# EAGLE design motoko_ice_dragon_x_bldc (EAGLE 9.6.0)
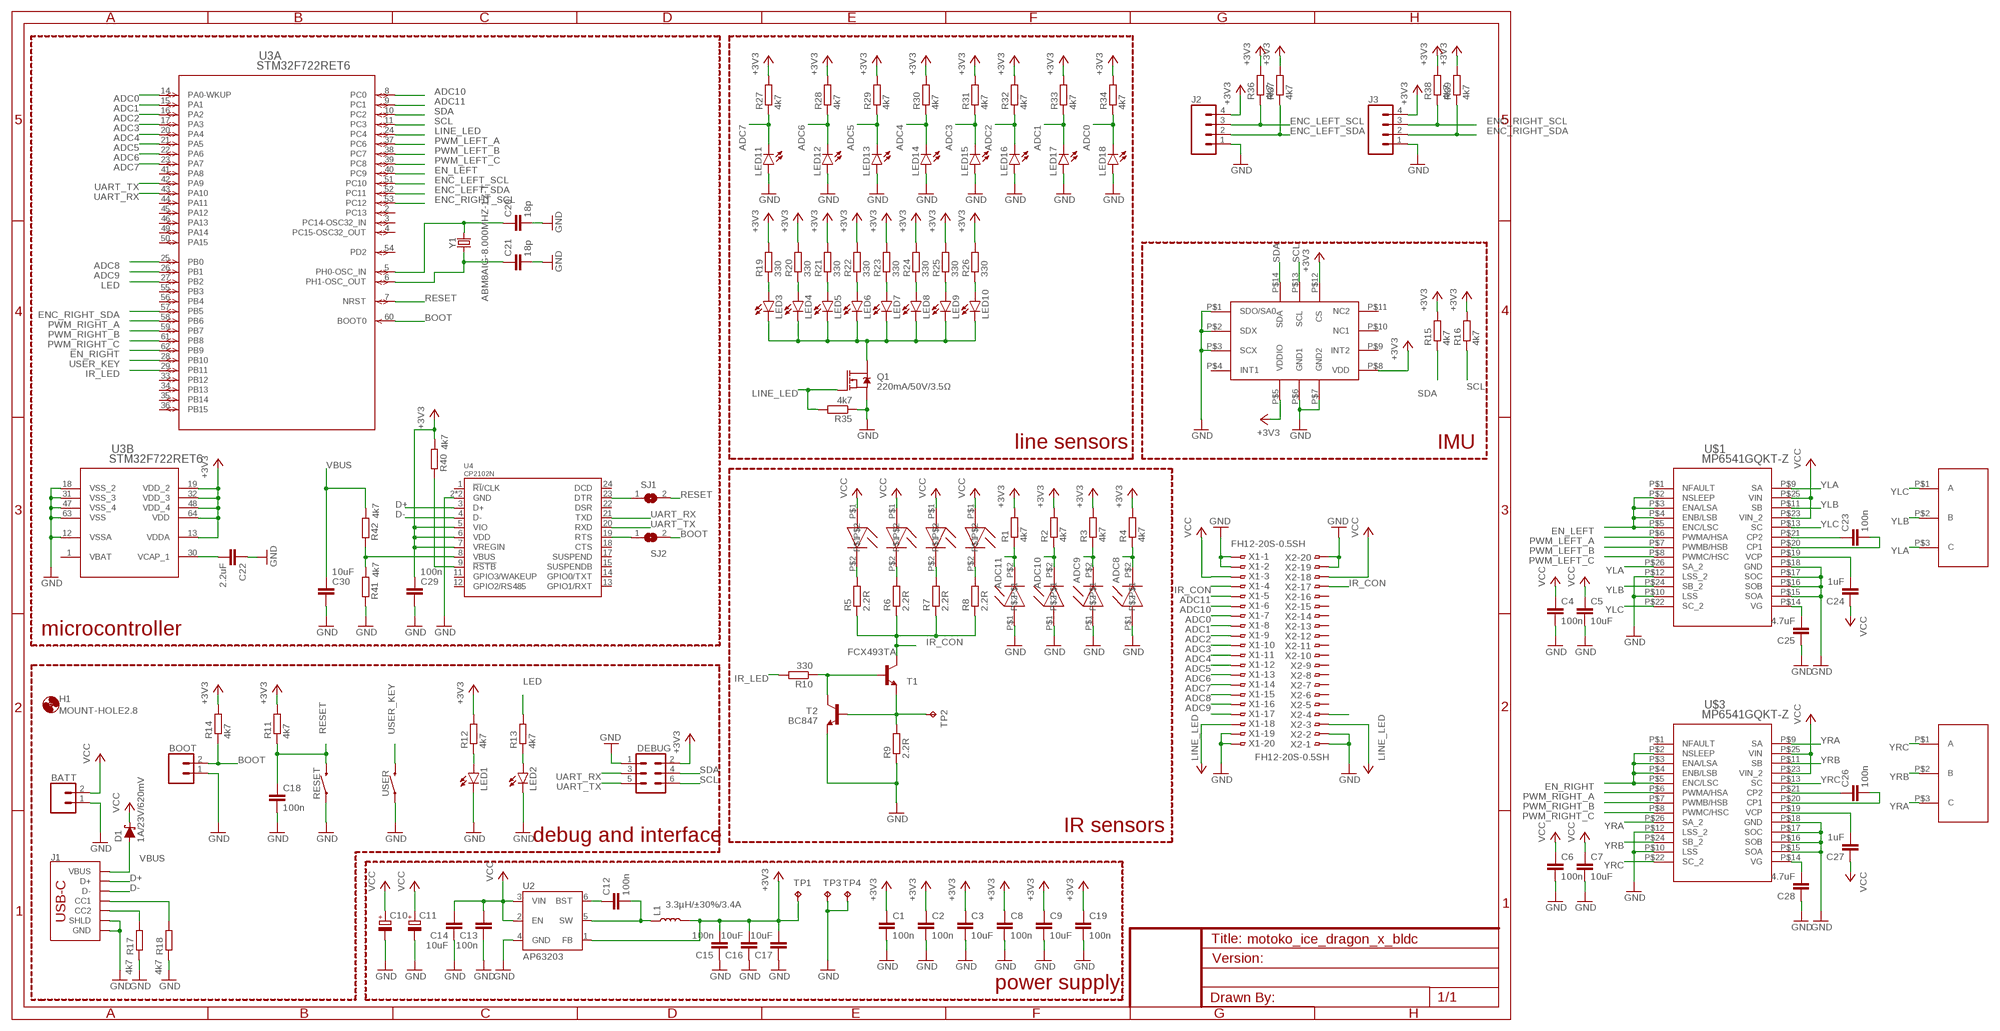
[diagram p0: schematic, sheet 1]

## Parts
BATT  CONN_02LOCK_LONGPADS  [1X02_LOCK_LONGPADS]
BOOT  CONN_02LOCK_LONGPADS  [1X02_LOCK_LONGPADS]
C1  100n  C-EUC0805  [C0805]
C2  100n  C-EUC0805  [C0805]
C3  10uF  C-EUC0805  [C0805]
C4  100n  C-EUC0805  [C0805]
C5  10uF  C-EUC0805  [C0805]
C6  100n  C-EUC0805  [C0805]
C7  10uF  C-EUC0805  [C0805]
C8  100n  C-EUC0805  [C0805]
C9  10uF  C-EUC0805  [C0805]
C10  CPOL-EU140CLH-0810  [140CLH-0810]
C11  CPOL-EU140CLH-0810  [140CLH-0810]
C12  100n  C-EUC0805  [C0805]
C13  100n  C-EUC0805  [C0805]
C14  10uF  C-EUC0805  [C0805]
C15  100n  C-EUC0805  [C0805]
C16  10uF  C-EUC0805  [C0805]
C17  10uF  C-EUC0805  [C0805]
C18  100n  C-EUC0805  [C0805]
C19  100n  C-EUC0805  [C0805]
C20  18p  C-EUC0805  [C0805]
C21  18p  C-EUC0805  [C0805]
C22  2.2uF  C-EUC0805  [C0805]
C23  100n  C-EUC0805  [C0805]
C24  1uF  C-EUC0805  [C0805]
C25  4.7uF  C-EUC0805  [C0805]
C26  100n  C-EUC0805  [C0805]
C27  1uF  C-EUC0805  [C0805]
C28  4.7uF  C-EUC0805  [C0805]
C29  100n  C-EUC0805  [C0805]
C30  10uF  C-EUC0805  [C0805]
D1  1A/23V/620mV  DIODE-SCHOTTKY-BAT20J  [SOD-323]
DEBUG  FEMALE 2x3  CONN_03X2FEMALE  [2X3]
H1  MOUNT-HOLE2.8  [2,8]
J1  640-USB4105-GF-A-120, man. GCT  USB_C_2-LAYER_PADS  [USB-C-16P-2LAYER-PADS]
J2  CONN_04LONGPADS  [1X04_LONGPADS]
J3  CONN_04LONGPADS  [1X04_LONGPADS]
L1  3.3µH/±30%/3.4A  INDUCTOR-CR54-3.3UH  [CR54]
LED1  LEDCHIPLED_1206  [CHIPLED_1206]
LED2  LEDCHIPLED_1206  [CHIPLED_1206]
LED3  LEDCHIPLED_1206  [CHIPLED_1206]
LED4  LEDCHIPLED_1206  [CHIPLED_1206]
LED5  LEDCHIPLED_1206  [CHIPLED_1206]
LED6  LEDCHIPLED_1206  [CHIPLED_1206]
LED7  LEDCHIPLED_1206  [CHIPLED_1206]
LED8  LEDCHIPLED_1206  [CHIPLED_1206]
LED9  LEDCHIPLED_1206  [CHIPLED_1206]
LED10  LEDCHIPLED_1206  [CHIPLED_1206]
LED11  LEDCHIPLED_1206  [CHIPLED_1206]
LED12  LEDCHIPLED_1206  [CHIPLED_1206]
LED13  LEDCHIPLED_1206  [CHIPLED_1206]
LED14  LEDCHIPLED_1206  [CHIPLED_1206]
LED15  LEDCHIPLED_1206  [CHIPLED_1206]
LED16  LEDCHIPLED_1206  [CHIPLED_1206]
LED17  LEDCHIPLED_1206  [CHIPLED_1206]
LED18  LEDCHIPLED_1206  [CHIPLED_1206]
Q1  220mA/50V/3.5Ω  MOSFET-NCH-BSS138  [SOT23-3]
R1  4k7  R-EU_M0805  [M0805]
R2  4k7  R-EU_M0805  [M0805]
R3  4k7  R-EU_M0805  [M0805]
R4  4k7  R-EU_M0805  [M0805]
R5  2.2R  R-EU_M0805  [M0805]
R6  2.2R  R-EU_M0805  [M0805]
R7  2.2R  R-EU_M0805  [M0805]
R8  2.2R  R-EU_M0805  [M0805]
R9  2.2R  R-EU_M0805  [M0805]
R10  330  R-EU_M0805  [M0805]
R11  4k7  R-EU_M0805  [M0805]
R12  4k7  R-EU_M0805  [M0805]
R13  4k7  R-EU_M0805  [M0805]
R14  4k7  R-EU_M0805  [M0805]
R15  4k7  R-EU_M0805  [M0805]
R16  4k7  R-EU_M0805  [M0805]
R17  4k7  R-EU_M0805  [M0805]
R18  4k7  R-EU_M0805  [M0805]
R19  330  R-EU_M0805  [M0805]
R20  330  R-EU_M0805  [M0805]
R21  330  R-EU_M0805  [M0805]
R22  330  R-EU_M0805  [M0805]
R23  330  R-EU_M0805  [M0805]
R24  330  R-EU_M0805  [M0805]
R25  330  R-EU_M0805  [M0805]
R26  330  R-EU_M0805  [M0805]
R27  4k7  R-EU_M0805  [M0805]
R28  4k7  R-EU_M0805  [M0805]
R29  4k7  R-EU_M0805  [M0805]
R30  4k7  R-EU_M0805  [M0805]
R31  4k7  R-EU_M0805  [M0805]
R32  4k7  R-EU_M0805  [M0805]
R33  4k7  R-EU_M0805  [M0805]
R34  4k7  R-EU_M0805  [M0805]
R35  4k7  R-EU_M0805  [M0805]
R36  4k7  R-EU_M0805  [M0805]
R37  4k7  R-EU_M0805  [M0805]
R38  4k7  R-EU_M0805  [M0805]
R39  4k7  R-EU_M0805  [M0805]
R40  4k7  R-EU_M0805  [M0805]
R41  4k7  R-EU_M0805  [M0805]
R42  4k7  R-EU_M0805  [M0805]
RESET  MOMENTARY-SWITCH-SPST-SMD-6.2MM-TALL  [TACTILE_SWITCH_SMD_6.2MM_TALL]
SJ1  SJ  [SJ]
SJ2  SJ  [SJ]
T1  FCX493TA  -NPN-SOT89-BCE  [SOT89-BCE]
T2  BC847  [SOT23]
TP1  TPB1,27  [B1,27]
TP2  TPB1,27  [B1,27]
TP3  TPB1,27  [B1,27]
TP4  TPB1,27  [B1,27]
U2  AP63203  [SOT23-6]
U3  STM32F722RET6  [LQFP64-10X10MM]
U4  CP2102N  [QFN24]
U$1  MP6541GQKT-Z  [TQFN-26]
U$2  BRUSHLESS_GIMBAL_MOTOR_WHEEL  [BRUSHLESS_GIMBAL_MOTOR_WHEEL]
U$3  MP6541GQKT-Z  [TQFN-26]
U$4  BRUSHLESS_GIMBAL_MOTOR_WHEEL  [BRUSHLESS_GIMBAL_MOTOR_WHEEL]
U$6  LSM6DSM  [LGA14L]
U$7  LED_5MM_AXIAL  [LED_5MM_AXIAL]
U$8  LED_5MM_AXIAL  [LED_5MM_AXIAL]
U$9  LED_5MM_AXIAL  [LED_5MM_AXIAL]
U$10  LED_5MM_AXIAL  [LED_5MM_AXIAL]
U$11  LED_5MM_AXIAL  [LED_5MM_AXIAL]
U$12  LED_5MM_AXIAL  [LED_5MM_AXIAL]
U$13  LED_5MM_AXIAL  [LED_5MM_AXIAL]
U$14  LED_5MM_AXIAL  [LED_5MM_AXIAL]
USER  MOMENTARY-SWITCH-SPST-SMD-6.2MM-TALL  [TACTILE_SWITCH_SMD_6.2MM_TALL]
X1  FH12-20S-0.5SH  [FH12-20S-0.5SH]
X2  FH12-20S-0.5SH  [FH12-20S-0.5SH]
Y1  ABM8AIG-8.000MHZ-1Z-T  CRYSTALSMD-3.2X2.5  [CRYSTAL-SMD-3.2X2.5MM]

## Nets
+3V3: C1.1 C2.1 C3.1 C8.1 C9.1 C15.2 C16.2 C17.2 C19.1 C29.1 DEBUG.2 J2.4 J3.4 L1.P$2 R1.2 R2.2 R3.2 R4.2 R11.2 R12.2 R14.2 R15.2 R16.2 R19.2 R20.2 R21.2 R22.2 R23.2 R24.2 R25.2 R26.2 R27.2 R28.2 R29.2 R30.2 R31.2 R32.2 R33.2 R34.2 R36.2 R37.2 R38.2 R39.2 R40.1 TP1.TP U2.1(FB) U3.13(B:VDDA) U3.19(B:VDD_2) U3.32(B:VDD_3) U3.48(B:VDD_4) U3.64(B:VDD) U4.5(VIO) U4.6(VDD) U4.7(VREGIN) U$6.P$5(VDDIO) U$6.P$8(VDD) U$6.P$12(CS) X1.18 X2.3
ADC0: LED18.C R34.1 U3.14(A:PA0-WKUP) X1.7
ADC1: LED17.C R33.1 U3.15(A:PA1) X1.8
ADC2: LED16.C R32.1 U3.16(A:PA2) X1.9
ADC3: LED15.C R31.1 U3.17(A:PA3) X1.10
ADC4: LED14.C R30.1 U3.20(A:PA4) X1.11
ADC5: LED13.C R29.1 U3.21(A:PA5) X1.12
ADC6: LED12.C R28.1 U3.22(A:PA6) X1.13
ADC7: LED11.C R27.1 U3.23(A:PA7) X1.14
ADC8: R4.1 U3.25(A:PB0) U$7.P$2 X1.15
ADC9: R3.1 U3.26(A:PB1) U$11.P$2 X1.16
ADC10: R2.1 U3.8(A:PC0) U$14.P$2 X1.6
ADC11: R1.1 U3.9(A:PC1) U$9.P$2 X1.5
BOOT: BOOT.2 R14.1 SJ2.2 U3.60(A:BOOT0)
D+: J1.A6(D+) J1.B6(D+) U4.3(D+)
D-: J1.A7(D-) J1.B7(D-) U4.4(D-)
EN_LEFT: U3.40(A:PC9) U$1.P$2(NSLEEP) U$1.P$3(ENA/LSA) U$1.P$4(ENB/LSB) U$1.P$5(ENC/LSC)
EN_RIGHT: U3.62(A:PB9) U$3.P$2(NSLEEP) U$3.P$3(ENA/LSA) U$3.P$4(ENB/LSB) U$3.P$5(ENC/LSC)
ENC_LEFT_SCL: J2.3 R36.1 U3.51(A:PC10)
ENC_LEFT_SDA: J2.2 R37.1 U3.52(A:PC11)
ENC_RIGHT_SCL: J3.3 R38.1 U3.53(A:PC12)
ENC_RIGHT_SDA: J3.2 R39.1 U3.57(A:PB5)
GND: BATT.1 BOOT.1 C1.2 C2.2 C3.2 C4.2 C5.2 C6.2 C7.2 C8.2 C9.2 C10.- C11.- C13.1 C14.1 C15.1 C16.1 C17.1 C18.2 C19.2 C20.2 C21.2 C22.1 C25.1 C28.1 C29.2 C30.2 DEBUG.1 J1.GND J1.GND2(GND) J1.SHLD1(SHLD) J1.SHLD2(SHLD) J1.SHLD3(SHLD) J1.SHLD4(SHLD) J2.1 J3.1 LED1.C LED2.C LED11.A LED12.A LED13.A LED14.A LED15.A LED16.A LED17.A LED18.A Q1.2(S) R9.1 R17.1 R18.1 R35.1 R41.2 RESET.A2 T2.2(E) TP3.TP TP4.TP U2.4(GND) U3.12(B:VSSA) U3.18(B:VSS_2) U3.31(B:VSS_3) U3.47(B:VSS_4) U3.63(B:VSS) U4.2(GND) U4.PAD(GND) U$1.P$10(LSS) U$1.P$12(LSS_2) U$1.P$15(SOA) U$1.P$16(SOB) U$1.P$17(SOC) U$1.P$18(GND) U$3.P$10(LSS) U$3.P$12(LSS_2) U$3.P$15(SOA) U$3.P$16(SOB) U$3.P$17(SOC) U$3.P$18(GND) U$6.P$1(SDO/SA0) U$6.P$2(SDX) U$6.P$3(SCX) U$6.P$6(GND1) U$6.P$7(GND2) U$7.P$1 U$9.P$1 U$11.P$1 U$14.P$1 USER.A2 X1.1 X1.2 X1.19 X1.20 X2.1 X2.2 X2.19 X2.20
IR_CON: R5.1 R6.1 R7.1 R8.1 T1.C X1.4 X2.17
IR_LED: R10.2 U3.29(A:PB11)
LED: R13.2 U3.27(A:PB2)
LINE_LED: Q1.1(G) R35.2 U3.24(A:PC4) X1.17 X2.4
LINE_LED_CON: LED3.C LED4.C LED5.C LED6.C LED7.C LED8.C LED9.C LED10.C Q1.3(D)
N$1: C23.1 U$1.P$21(CP2)
N$2: C23.2 U$1.P$20(CP1)
N$3: C24.2 U$1.P$19(VCP)
N$4: C25.2 U$1.P$14(VG)
N$5: R5.2 U$10.P$2
N$6: R6.2 U$13.P$2
N$7: R7.2 U$12.P$2
N$8: R8.2 U$8.P$2
N$10: R9.2 T1.E T2.1(B) TP2.TP
N$11: J1.B5(CC2) R17.2
N$12: C12.1 U2.6(BST)
N$13: C12.2 L1.P$1 U2.5(SW)
N$14: R10.1 T1.B T2.3(C)
N$16: LED1.A R12.1
N$17: LED2.A R13.1
N$18: J1.A5(CC1) R18.2
N$19: C20.1 U3.5(A:PH0-OSC_IN) Y1.3
N$20: C21.1 U3.6(A:PH1-OSC_OUT) Y1.1
N$21: LED3.A R19.1
N$22: LED4.A R20.1
N$23: C22.2 U3.30(B:VCAP_1)
N$24: LED5.A R21.1
N$25: LED6.A R22.1
N$26: LED7.A R23.1
N$27: LED8.A R24.1
N$28: LED9.A R25.1
N$29: LED10.A R26.1
N$31: C26.1 U$3.P$21(CP2)
N$32: C26.2 U$3.P$20(CP1)
N$33: SJ1.1 U4.23(DTR)
N$34: SJ2.1 U4.19(RTS)
N$35: C27.2 U$3.P$19(VCP)
N$36: C28.2 U$3.P$14(VG)
N$37: R40.2 U4.9(!RSTB)
N$38: R41.1 R42.2 U4.8(VBUS)
PWM_LEFT_A: U3.37(A:PC6) U$1.P$6(PWMA/HSA)
PWM_LEFT_B: U3.38(A:PC7) U$1.P$7(PWMB/HSB)
PWM_LEFT_C: U3.39(A:PC8) U$1.P$8(PWMC/HSC)
PWM_RIGHT_A: U3.58(A:PB6) U$3.P$6(PWMA/HSA)
PWM_RIGHT_B: U3.59(A:PB7) U$3.P$7(PWMB/HSB)
PWM_RIGHT_C: U3.61(A:PB8) U$3.P$8(PWMC/HSC)
RESET: C18.1 R11.1 RESET.B2 SJ1.2 U3.7(A:NRST)
SCL: DEBUG.6 R16.1 U3.11(A:PC3) U$6.P$13(SCL)
SDA: DEBUG.4 R15.1 U3.10(A:PC2) U$6.P$14(SDA)
UART_RX: DEBUG.3 U3.43(A:PA10) U4.21(TXD)
UART_TX: DEBUG.5 U3.42(A:PA9) U4.20(RXD)
USER_KEY: U3.28(A:PB10) USER.B2
VBUS: C30.1 D1.A J1.VBUS1(VBUS) J1.VBUS2(VBUS) R42.1
VCC: BATT.2 C4.1 C5.1 C6.1 C7.1 C10.+ C11.+ C13.2 C14.2 C24.1 C27.1 D1.C U2.2(EN) U2.3(VIN) U$1.P$23(VIN_2) U$1.P$25(VIN) U$3.P$23(VIN_2) U$3.P$25(VIN) U$8.P$1 U$10.P$1 U$12.P$1 U$13.P$1 X1.3 X2.18
YLA: U$1.P$9(SA) U$1.P$26(SA_2) U$2.P$3(C)
YLB: U$1.P$11(SB) U$1.P$24(SB_2) U$2.P$2(B)
YLC: U$1.P$13(SC) U$1.P$22(SC_2) U$2.P$1(A)
YRA: U$3.P$9(SA) U$3.P$26(SA_2) U$4.P$3(C)
YRB: U$3.P$11(SB) U$3.P$24(SB_2) U$4.P$2(B)
YRC: U$3.P$13(SC) U$3.P$22(SC_2) U$4.P$1(A)
Unconnected: U3.2(A:PC13) U3.3(A:PC14-OSC32_IN) U3.4(A:PC15-OSC32_OUT) U3.33(A:PB12) U3.34(A:PB13) U3.35(A:PB14) U3.36(A:PB15) U3.41(A:PA8) U3.44(A:PA11) U3.45(A:PA12) U3.46(A:PA13) U3.49(A:PA14) U3.50(A:PA15) U3.54(A:PD2) U3.55(A:PB3) U3.56(A:PB4) U4.1(!RI!/CLK) U4.11(GPIO3/WAKEUP) U4.12(GPIO2/RS485) U4.13(GPIO1/RXT) U4.14(GPIO0/TXT) U4.15(SUSPENDB) U4.17(SUSPEND) U4.18(CTS) U4.22(DSR) U4.24(DCD) U$1.P$1(NFAULT) U$3.P$1(NFAULT) U$6.P$4(INT1) U$6.P$9(INT2) U$6.P$10(NC1) U$6.P$11(NC2) X2.5 X2.6 X2.7 X2.8 X2.9 X2.10 X2.11 X2.12 X2.13 X2.14 X2.15 X2.16

## Notes on the sheet
- line sensors | IMU
- microcontroller
- IR sensors
- debug and interface
- power supply

## Power pins joined to a net without a drawn wire
VBAT: U3.1(B:VBAT)

## Library data of the parts
BATT BOOT = SparkFun-Connectors:CONN_02: Multi connection point. Often used as Generic Header-pin footprint for 0.1 inch spaced/style header connections On any of the 0.1 inch spaced packages, you can populate with these: Break Away Headers - Straight <https://www.sparkfun.com/products/116> (PRT-00116) Break Away Male Headers - Right Angle <https://www.sparkfun.com/products/553> (PRT-00553) Female Headers <https://www.sparkfun.com/products/115> (PRT-00115) Break Away Headers - Machine Pin <https://www.sparkfun.com/products/117> (PRT-00117) Break Away Female Headers - Swiss Machine Pin <https://www.sparkfun.com/products/743> (PRT-00743) For SCREWTERMINALS and SPRING TERMINALS visit here: Screw Terimnals on SparkFun.com <https://www.sparkfun.com/search/results?term=Screw+Terminals> (5mm/3.5mm/2.54mm spacing) This device is also useful as a general connection point to wire up your design to another part of your project. Our various solder wires solder well into these plated through hole pads. Hook-Up Wire - Assortment (Stranded, 22 AWG) <https://www.sparkfun.com/products/11375> (PRT-11375) Hook-Up Wire - Assortment (Solid Core, 22 AWG) <https://www.sparkfun.com/products/11367> (PRT-11367) View the entire wire category on our website here <https://www.sparkfun.com/categories/141> Special notes: Molex polarized connector foot print use with: PRT-08233 with associated crimp pins and housings. 2.54_SCREWTERM for use with PRT-10571. 3.5mm Screw Terminal footprints for PRT-08084 5mm Screw Terminal footprints for use with PRT-08432
C1-C9 C12-C30 = rcl:C-EU: CAPACITOR, European symbol; SPICEPREFIX: C
C10 C11 = rcl:CPOL-EU: POLARIZED CAPACITOR, European symbol; SPICEPREFIX: C
D1 = SparkFun-DiscreteSemi:DIODE-SCHOTTKY: Schottky diode A Schottky diode is a semiconductor diode which has a low forward voltage drop and a very fast switching action.; PROD_ID: DIO-11623
DEBUG = SparkFun-Connectors:CONN_03X2: Multi connection point. Often used as Generic Header-pin footprint for 0.1 inch spaced/style header connections You can populate with any combo of single row headers, but if you'd like an exact match, check these: Header - 2x3 (Male, 0.1") <https://www.sparkfun.com/products/12807> (PRT-12807) Header - 2x3 (Female, 0.1") <https://www.sparkfun.com/products/13010> (PRT-13010) 2x3 Pin Shrouded Header <https://www.sparkfun.com/products/10877> (PRT-10877) On any of the 0.1 inch spaced packages, you can populate with these: Break Away Headers - Straight <https://www.sparkfun.com/products/116> (PRT-00116) Break Away Male Headers - Right Angle <https://www.sparkfun.com/products/553> (PRT-00553) Female Headers <https://www.sparkfun.com/products/115> (PRT-00115) Break Away Headers - Machine Pin <https://www.sparkfun.com/products/117> (PRT-00117) Break Away Female Headers - Swiss Machine Pin <https://www.sparkfun.com/products/743> (PRT-00743) Special note: the shrouded connector mates well with our 3x2 ribbon cables: Ribbon Crimp Connector - 6-pin (2x3, Female) <https://www.sparkfun.com/products/10651> (PRT-10651) Ribbon Cable - 6 wire (15ft) <https://www.sparkfun.com/products/10646> (PRT-10646); PROD_ID: CONN-11566
H1 = holes:MOUNT-HOLE: MOUNTING HOLE with drill center marker
J1 = SparkFun-Connectors:USB_C: USB Type C 16Pin Connector Super Speed pins not available on the 16-pin purely SMD connector so this part is best for USB 2.0 implementations. D1 and D2 are tied together enabling D+/- no matter which way the cable is plugged into the connector. The two channel configuration pins (CC1/2) are exposed. These are normally connected to ground via 5.1k resistors but can be reconfigured for high current/high power applications.; PROD_ID: CONN-14122
J2 J3 = SparkFun-Connectors:CONN_04: Multi connection point. Often used as Generic Header-pin footprint for 0.1 inch spaced/style header connections On any of the 0.1 inch spaced packages, you can populate with these: Break Away Headers - Straight <https://www.sparkfun.com/products/116> (PRT-00116) Break Away Male Headers - Right Angle <https://www.sparkfun.com/products/553> (PRT-00553) Female Headers <https://www.sparkfun.com/products/115> (PRT-00115) Break Away Headers - Machine Pin <https://www.sparkfun.com/products/117> (PRT-00117) Break Away Female Headers - Swiss Machine Pin <https://www.sparkfun.com/products/743> (PRT-00743) For SCREWTERMINALS and SPRING TERMINALS visit here: Screw Terimnals on SparkFun.com <https://www.sparkfun.com/search/results?term=Screw+Terminals> (5mm/3.5mm/2.54mm spacing) This device is also useful as a general connection point to wire up your design to another part of your project. Our various solder wires solder well into these plated through hole pads. Hook-Up Wire - Assortment (Stranded, 22 AWG) <https://www.sparkfun.com/products/11375> (PRT-11375) Hook-Up Wire - Assortment (Solid Core, 22 AWG) <https://www.sparkfun.com/products/11367> (PRT-11367) View the entire wire category on our website here <https://www.sparkfun.com/categories/141> Special notes: Molex polarized connector foot print use with SKU : PRT-08231 with associated crimp pins and housings. 1MM SMD Version SKU: PRT-10208; PROD_ID: CONN-09696
L1 = SparkFun-Coils:INDUCTOR: Inductors Resist changes in electrical current. Basically a coil of wire. SparkFun Products: SparkFun Load Cell Amplifier - HX711 <https://www.sparkfun.com/products/13879> IOIO-OTG - V2.2 <https://www.sparkfun.com/products/13613>; PROD_ID: NDUC-11157
LED1-LED18 = led:LED: LED OSRAM: - CHIPLED LG R971, LG N971, LY N971, LG Q971, LY Q971, LO R971, LY R971 LH N974, LH R974 LS Q976, LO Q976, LY Q976 LO Q996 - Hyper CHIPLED LW Q18S LB Q993, LB Q99A, LB R99A - SideLED LS A670, LO A670, LY A670, LG A670, LP A670 LB A673, LV A673, LT A673, LW A673 LH A674 LY A675 LS A676, LA A676, LO A676, LY A676, LW A676 LS A679, LY A679, LG A679 - Hyper Micro SIDELED® LS Y876, LA Y876, LO Y876, LY Y876 LT Y87S - SmartLED LW L88C, LW L88S LB L89C, LB L89S, LG L890 LS L89K, LO L89K, LY L89K LS L896, LA L896, LO L896, LY L896 - TOPLED LS T670, LO T670, LY T670, LG T670, LP T670 LSG T670, LSP T670, LSY T670, LOP T670, LYG T670 LG T671, LOG T671, LSG T671 LB T673, LV T673, LT T673, LW T673 LH T674 LS T676, LA T676, LO T676, LY T676, LB T676, LH T676, LSB T676, LW T676 LB T67C, LV T67C, LT T67C, LS T67K, LO T67K, LY T67K, LW E67C LS E67B, LA E67B, LO E67B, LY E67B, LB E67C, LV E67C, LT E67C LW T67C LS T679, LY T679, LG T679 LS T770, LO T770, LY T770, LG T770, LP T770 LB T773, LV T773, LT T773, LW T773 LH T774 LS E675, LA E675, LY E675, LS T675 LS T776, LA T776, LO T776, LY T776, LB T776 LHGB T686 LT T68C, LB T68C - Hyper Mini TOPLED® LB M676 - Mini TOPLED Santana® LG M470 LS M47K, LO M47K, LY M47K Source: http://www.osram.convergy.de LUXEON: - LUMILED® LXK2-PW12-R00, LXK2-PW12-S00, LXK2-PW14-U00, LXK2-PW14-V00 LXK2-PM12-R00, LXK2-PM12-S00, LXK2-PM14-U00 LXK2-PE12-Q00, LXK2-PE12-R00, LXK2-PE12-S00, LXK2-PE14-T00, LXK2-PE14-U00 LXK2-PB12-K00, LXK2-PB12-L00, LXK2-PB12-M00, LXK2-PB14-N00, LXK2-PB14-P00, LXK2-PB14-Q00 LXK2-PR12-L00, LXK2-PR12-M00, LXK2-PR14-Q00, LXK2-PR14-R00 LXK2-PD12-Q00, LXK2-PD12-R00, LXK2-PD12-S00 LXK2-PH12-R00, LXK2-PH12-S00 LXK2-PL12-P00, LXK2-PL12-Q00, LXK2-PL12-R00 Source: www.luxeon.com KINGBRIGHT: KA-3528ASYC Source: www.kingbright.com
Q1 = SparkFun-DiscreteSemi:MOSFET-NCH: N-channel MOSFETs Voltage controlled devices that allow control of high current outputs. SparkFun Products: SparkFun OpenScale <https://www.sparkfun.com/products/13261> SparkFun Digital Sandbox <https://www.sparkfun.com/products/12651> SparkFun Monster Moto Shield <https://www.sparkfun.com/products/10182> SparkFun MOSFET Power Controller <https://www.sparkfun.com/products/11214>; PROD_ID: TRANS-00830
R1-R42 = rcl:R-EU_: RESISTOR, European symbol; SPICEPREFIX: R
RESET USER = SparkFun-Switches:MOMENTARY-SWITCH-SPST: Momentary Switch (Pushbutton) - SPST Normally-open (NO) SPST momentary switches (buttons, pushbuttons). Variants PTH-12MM - 12mm square, through-hole Momentary Pushbutton Switch - 12mm Square <https://www.sparkfun.com/products/9190> (COM-09190) PTH-6.0MM, PTH-6.0MM-KIT - 6.0mm square, through-hole Mini Pushbutton Switch <https://www.sparkfun.com/products/97> (COM-00097) KIT package intended for soldering kit's - only one side of pads' copper is exposed. PTH-RIGHT-ANGLE-KIT - Right-angle, through-hole Right Angle Tactile Button <https://www.sparkfun.com/products/10791> - Used on SparkFun BigTime Watch Kit <https://www.sparkfun.com/products/11734> SMD-12MM - 12mm square, surface-mount Tactile Button - SMD (12mm) <https://www.sparkfun.com/products/12993> (COM-12993) Used on SparkFun PicoBoard <https://www.sparkfun.com/products/11888> SMD-4.5MM - 4.5mm Square Trackball Switch Used on SparkFun Blackberry Trackballer Breakout <https://www.sparkfun.com/products/13169> SMD-4.6MMX2.8MM - 4.60mm x 2.80mm, surface mount Used on SparkFun SAMD21 Mini Breakout <https://www.sparkfun.com/products/13664> SMD-5.2MM, SMD-5.2-REDUNDANT - 5.2mm square, surface-mount Mini Pushbutton Switch - SMD <https://www.sparkfun.com/products/8720> (COM-08720) Used on Arduino Pro Mini <https://www.sparkfun.com/products/11114> REDUNDANT package connects both switch circuits together SMD-6.0X3.5MM - 6.0 x 3.5mm, surface mount Momentary Reset Switch SMD <https://www.sparkfun.com/products/8229> (COM-08229) SMD-6.2MM-TALL - 6.2mm square, surface mount Tactile Button - SMD (6mm) <https://www.sparkfun.com/products/12992> Used on SparkFun Digital Sandbox <https://www.sparkfun.com/products/12651> SMD-RIGHT-ANGLE - Right-angle, surface mount Used on SparkFun Block for Intel® Edison - Arduino <https://www.sparkfun.com/products/13036>; PROD_ID: SWCH-11966; SF_SKU: COM-12992
SJ1 SJ2 = jumper:SJ: SMD solder JUMPER
T1 = transistor:*-NPN-: NPN Transistror BF959 corrected 2008.03.06
T2 = transistor-neu-to92:BC847: NPN TRANSISTOR
TP1-TP4 = testpad:TP: Test pad
U2 = SparkFun-IC-Power:AP63203: Diodes Inc. AP63203 3.8V-32V input 3.3V Buck The AP63200/AP63201/AP63203/AP63205 is a 2A, synchronous buck converter with a wide input voltage range of 3.8V to 32V and fully integrates a 125mΩ high-side power MOSFET and a 68mΩ lowside power MOSFET to provide high-efficiency step-down DC/DC conversion; PROD_ID: VREG-15244
U3 = my_library:STM32F722RET6; COPYRIGHT: Copyright (C) 2024 Ultra Librarian. All rights reserved.; MANUFACTURER_PART_NUMBER: STM32F722RET6; MFR_NAME: STMicroelectronics
U4 = SparkFun-IC-Comms:CP2102N; PROD_ID: IC-14020
U$1 U$3 = my_library:MP6541GQKT-Z: 3 phase brushless driver, 40V, 8A, MP6541 : 3xPWM + 3xENABLE inputs MP6541A : 6xPWM (oposite pahses) prefer MP6541A with PWM and ENABLE inputs (requires inly 3 PWM channels) https://www.monolithicpower.com/en/mp6541.html
U$2 U$4 = my_library:BRUSHLESS_GIMBAL_MOTOR_WHEEL
U$6 = my_library:LSM6DSM
U$7-U$11 U$13 U$14 = my_library:LED_5MM_AXIAL
U$12 = my_library:LED_5MM_AXIAL; SPICEPREFIX: B
X1 X2 = con-hirose:FH12-20S-0.5S: 0.5mm Pitch Connectors For FPC/FFC Source: Data sheet <http://www.hirose.co.jp/cataloge_hp/e58605370.pdf>; MPN: FH12-20S-0.5SH(55); OC_FARNELL: 1324549; OC_NEWARK: 34M6166
Y1 = SparkFun-Clocks:CRYSTAL: Crystals (Generic) These are passive quartz crystals, which can be used as a clock source for a microcontroller. Crystal's are two-terminal devices. They require external "load" capacitors to generate an oscillating signal.

## Board
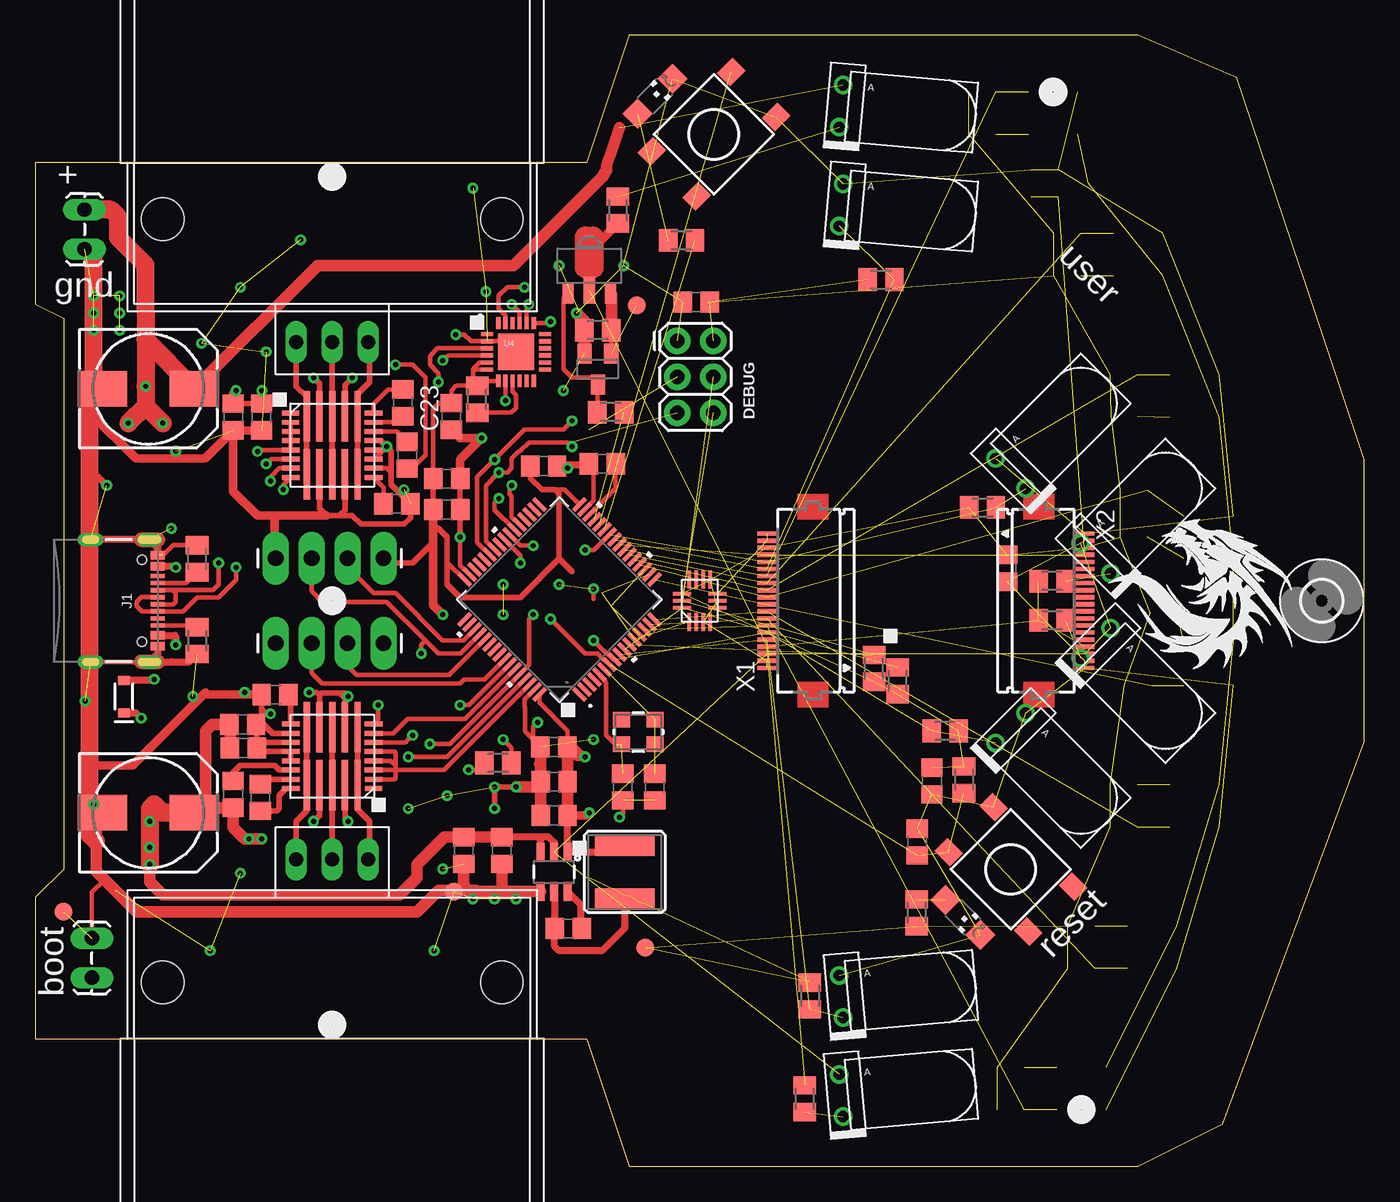
[diagram p1: board, top side]
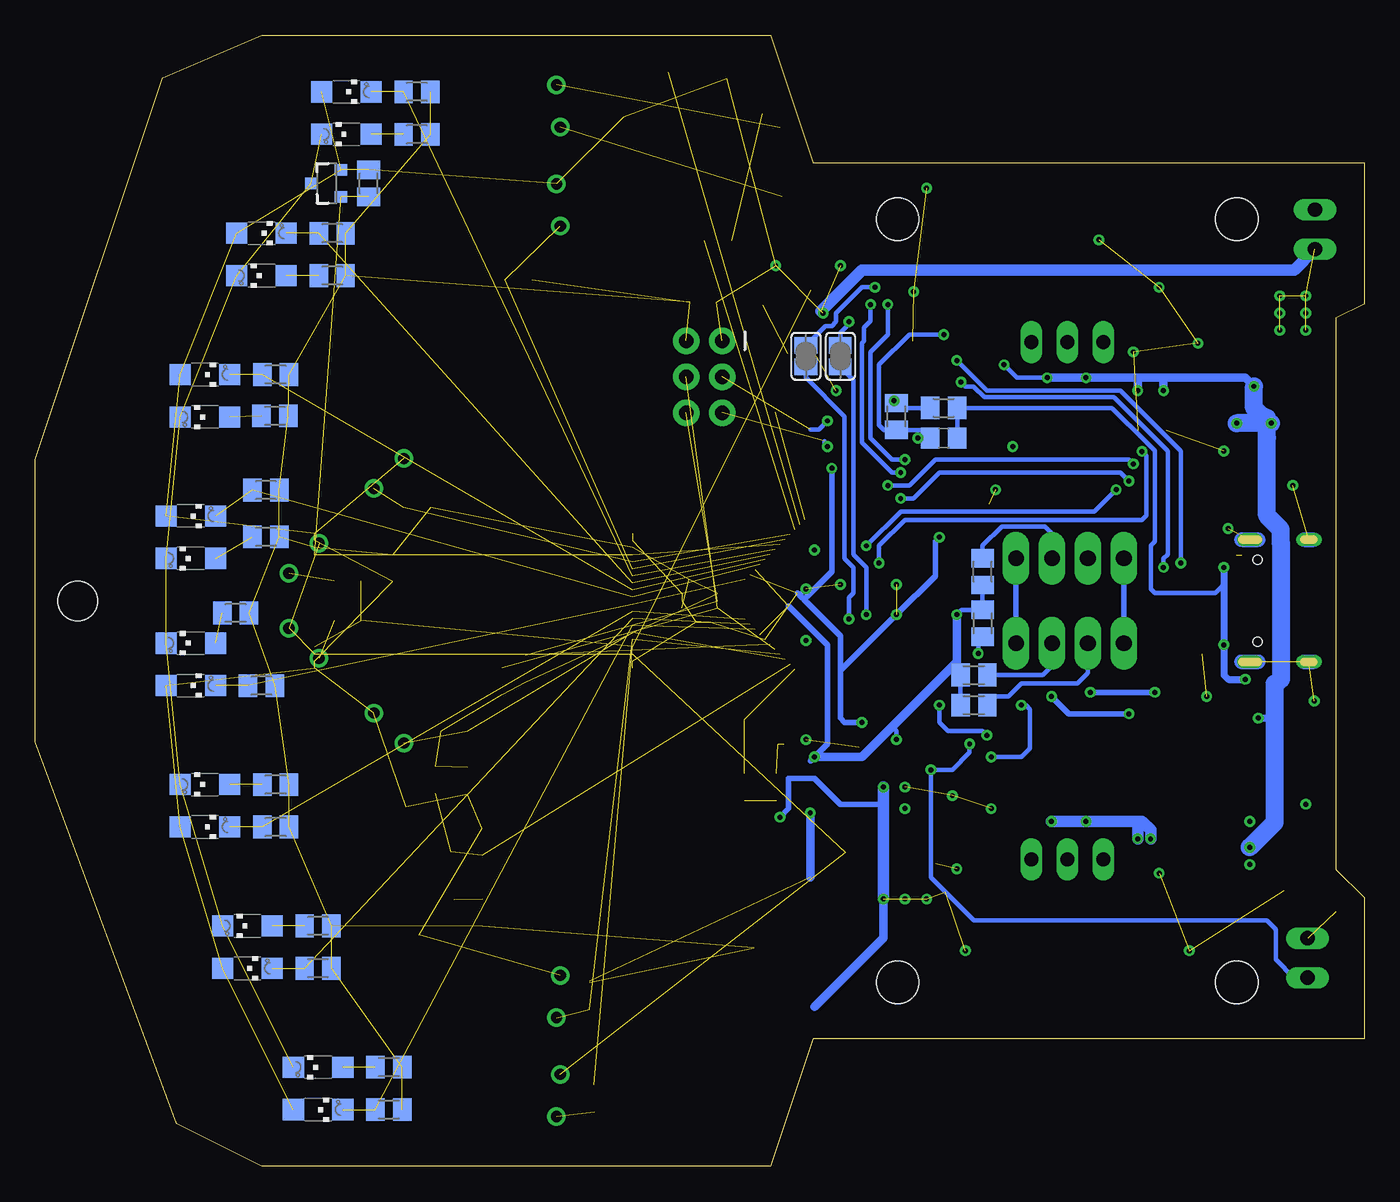
[diagram p2: board, bottom side, seen from below]

Size 94 x 80 mm. Coordinates in mm from the lower left corner, seen from the top.
Outline: 0,9 39,9 42,0 78,0 84,3 94,30 94,50 85,77 78,80 56,80 42,80 39,71 0,71 0,61 2,60 2,21 0,19 0,9
Copper layers (1*16): Top 0.035mm / dielectric 1.5mm / Bottom 0.035mm
Design rules "default": minimum track width 6mil, minimum drill 0.35mm, track to track 6mil, track to pad 6mil, pad to pad 6mil, via to via 6mil, smd to smd 6mil, copper to edge 40mil, drill to drill 6mil, minimum pad ring 10mil, minimum via ring 8mil, stop-mask expansion 4mil, vias tented up to drill 0mil, thermal gap 10mil

### Footprints (pad centres in the part's own frame; a part is rotated, then mirrored left to right if it is on the bottom)
1X02_LOCK_LONGPADS = drill 1.016 long: 1 -0.127,0; 2 2.667,0
C0805 = smd 1.3 x 1.5: 1 -0.95,0; 2 0.95,0
140CLH-0810 = smd 3.5 x 2.5: + 3.25,0; - -3.25,0
SOD-323 = smd 0.63 x 0.83: A 1.15,0; C -1.15,0
2X3 = drill 1.016 pad 1.88: 1 0,0; 2 0,2.54; 3 2.54,0; 4 2.54,2.54; 5 5.08,0; 6 5.08,2.54
2,8 = hole 2.8: 0,0
USB-C-16P-2LAYER-PADS = smd 0.3 x 1: A5 -1.25,-0.34; A6 -0.25,-0.34; A7 0.25,-0.34; A8 1.25,-0.34; B5 1.75,-0.34; B6 0.75,-0.34; B7 -0.75,-0.34; B8 -1.75,-0.34 | smd 0.6 x 1: GND -3.225,-0.34; GND2 3.225,-0.34; VBUS1 -2.45,-0.34; VBUS2 2.45,-0.34 | drill 0.4 pad 0.6 long: SHLD1 -4.318,-0.915; SHLD2 4.318,-0.915; SHLD3 -4.318,-5.095; SHLD4 4.318,-5.095 | hole 0.65: -2.89,-1.445; 2.89,-1.445
1X04_LONGPADS = drill 1.118 pad 1.88 long: 1 0,0; 2 2.54,0; 3 5.08,0; 4 7.62,0
CR54 = smd 4.2 x 1.4: P$1 0,1.85; P$2 0,-1.85
CHIPLED_1206 = smd 1.5 x 1.5: A 0,-1.75; C 0,1.75
SOT23-3 = smd 0.8 x 0.9: 1 -0.95,-1; 2 0.95,-1; 3 0,1.1
M0805 = smd 1.3 x 1.6: 1 -0.95,0; 2 0.95,0
TACTILE_SWITCH_SMD_6.2MM_TALL = smd 1.55 x 1.3: A1 -3.975,-2.25; A2 3.975,-2.25; B1 -3.975,2.25; B2 3.975,2.25
SJ = smd 1.168 x 1.6: 1 -0.762,0; 2 0.762,0
SOT89-BCE = smd 0.8 x 1.4: B -1.499,-1.981; E 1.499,-1.981 | smd 0.8 x 1.9: C 0,-1.727
SOT23 = smd 1 x 1.4: 1 -0.95,-1.1; 2 0.95,-1.1; 3 0,1.1
B1,27 = smd 1.27 x 1.27: TP 0,0
SOT23-6 = smd 0.55 x 1.35: 1 -0.95,-1.375; 2 0,-1.375; 3 0.95,-1.375; 4 0.95,1.375; 5 0,1.375; 6 -0.95,1.375
LQFP64-10X10MM = smd 1.194 x 0.305: 1 -5.75,3.75; 2 -5.75,3.25; 3 -5.75,2.75; 4 -5.75,2.25; 5 -5.75,1.75; 6 -5.75,1.25; 7 -5.75,0.75; 8 -5.75,0.25; 9 -5.75,-0.25; 10 -5.75,-0.75; 11 -5.75,-1.25; 12 -5.75,-1.75; 13 -5.75,-2.25; 14 -5.75,-2.75; 15 -5.75,-3.25; 16 -5.75,-3.75; 33 5.75,-3.75; 34 5.75,-3.25; 35 5.75,-2.75; 36 5.75,-2.25; 37 5.75,-1.75; 38 5.75,-1.25; 39 5.75,-0.75; 40 5.75,-0.25; 41 5.75,0.25; 42 5.75,0.75; 43 5.75,1.25; 44 5.75,1.75; 45 5.75,2.25; 46 5.75,2.75; 47 5.75,3.25; 48 5.75,3.75 | smd 0.305 x 1.194: 17 -3.75,-5.75; 18 -3.25,-5.75; 19 -2.75,-5.75; 20 -2.25,-5.75; 21 -1.75,-5.75; 22 -1.25,-5.75; 23 -0.75,-5.75; 24 -0.25,-5.75; 25 0.25,-5.75; 26 0.75,-5.75; 27 1.25,-5.75; 28 1.75,-5.75; 29 2.25,-5.75; 30 2.75,-5.75; 31 3.25,-5.75; 32 3.75,-5.75; 49 3.75,5.75; 50 3.25,5.75; 51 2.75,5.75; 52 2.25,5.75; 53 1.75,5.75; 54 1.25,5.75; 55 0.75,5.75; 56 0.25,5.75; 57 -0.25,5.75; 58 -0.75,5.75; 59 -1.25,5.75; 60 -1.75,5.75; 61 -2.25,5.75; 62 -2.75,5.75; 63 -3.25,5.75; 64 -3.75,5.75
QFN24 = smd 0.85 x 0.3: 1 -2.05,1.25; 2 -2.05,0.75; 3 -2.05,0.25; 4 -2.05,-0.25; 5 -2.05,-0.75; 6 -2.05,-1.25; 13 2.05,-1.25; 14 2.05,-0.75; 15 2.05,-0.25; 16 2.05,0.25; 17 2.05,0.75; 18 2.05,1.25 | smd 0.3 x 0.85: 7 -1.25,-2.05; 8 -0.75,-2.05; 9 -0.25,-2.05; 10 0.25,-2.05; 11 0.75,-2.05; 12 1.25,-2.05; 19 1.25,2.05; 20 0.75,2.05; 21 0.25,2.05; 22 -0.25,2.05; 23 -0.75,2.05; 24 -1.25,2.05 | smd 2.55 x 2.55: PAD 0,0
TQFN-26 = smd 1.2 x 0.35: P$1 -2.925,2.275; P$2 -2.925,1.625 | smd 1.25 x 0.35: P$3 -2.925,0.975; P$4 -2.925,0.325; P$5 -2.925,-0.325; P$6 -2.925,-0.975; P$7 -2.925,-1.625; P$8 -2.925,-2.275; P$14 2.925,-2.275; P$15 2.925,-1.625; P$16 2.925,-0.975; P$17 2.925,-0.325; P$18 2.925,0.325; P$19 2.925,0.975; P$20 2.925,1.625; P$21 2.925,2.275 | smd 0.45 x 3.55: P$9 -1.8,-2.05; P$10 -0.9,-2.05; P$11 0,-2.05; P$12 0.9,-2.05; P$13 1.8,-2.05; P$22 1.8,2.05; P$23 0.9,2.05; P$24 0,2.05; P$25 -0.9,2.05; P$26 -1.8,2.05
BRUSHLESS_GIMBAL_MOTOR_WHEEL = drill 1 long: P$1 12.7,2.54; P$2 12.7,0; P$3 12.7,-2.54 | hole 3: 4,-12; 4,12
LGA14L = smd 1.25 x 0.25: P$1 -1.5,0.75; P$2 -1.5,0.25; P$3 -1.5,-0.25; P$4 -1.5,-0.75; P$8 1.5,-0.75; P$9 1.5,-0.25; P$10 1.5,0.25; P$11 1.5,0.75 | smd 0.25 x 1.25: P$5 -0.5,-1.25; P$6 0,-1.25; P$7 0.5,-1.25; P$12 0.5,1.25; P$13 0,1.25; P$14 -0.5,1.25
LED_5MM_AXIAL = drill 0.8: P$1 0,1.5; P$2 0,-1.5
FH12-20S-0.5SH = smd 0.3 x 1.3: 1 -4.75,3.25; 2 -4.25,3.25; 3 -3.75,3.25; 4 -3.25,3.25; 5 -2.75,3.25; 6 -2.25,3.25; 7 -1.75,3.25; 8 -1.25,3.25; 9 -0.75,3.25; 10 -0.25,3.25; 11 0.25,3.25; 12 0.75,3.25; 13 1.25,3.25; 14 1.75,3.25; 15 2.25,3.25; 16 2.75,3.25; 17 3.25,3.25; 18 3.75,3.25; 19 4.25,3.25; 20 4.75,3.25
CRYSTAL-SMD-3.2X2.5MM = smd 1.2 x 1.1: 1 -1.175,-0.875; 2 1.175,-0.875; 3 1.175,0.875; 4 -1.175,0.875

### Placement (x,y rotation side)
BATT  3.48,65 90 top
BOOT  4,16 270 top
C1  35.95,49.52 0 top
C2  46.75,61.13 180 top
C3  63.42,27.25 270 top
C4  16,53 270 top
C5  14,53 270 top
C6  14.67,31.25 0 top
C7  14.72,29.59 0 top
C8  29.1,48.64 0 top
C9  29.1,46.46 0 top
C10  8,55 0 top
C11  8,25 0 top
C12  37.7,16.81 180 top
C13  33,22.34 90 top
C14  30.3,22.34 90 top
C15  36.7,27.2 0 top
C16  36.68,29.66 0 top
C17  36.7,24.81 0 top
C18  62.38,22.93 90 top
C19  68.72,42.3 270 top
C20  41.56,26.82 270 top
C21  43.82,26.82 270 top
C22  40.1,49.68 0 top
C23  26,54 270 top
C24  26.3,50.3 90 top
C25  25.58,46.86 180 top
C26  15.91,26.09 90 top
C27  13.99,26.3 90 top
C28  16.96,33.36 0 top
C29  29.43,53.04 270 top
C30  29.74,51.51 180 bottom
D1  6.27,33.22 90 top
DEBUG  45.42,58.39 270 top
H1  91,40 0 top
J1  9,40 270 top
J2  17,43 0 top
J3  17,37 0 top
L1  41.7,20.81 180 top
LED1  65.61,17.61 225 top
LED2  43.83,75.7 315 top
LED3  72,73 90 bottom
LED4  78,63 90 bottom
LED5  82,53 90 bottom
LED6  83,43 90 bottom
LED7  83,37 90 bottom
LED8  82,27 90 bottom
LED9  79,17 90 bottom
LED10  74,7 90 bottom
LED11  72,76 270 bottom
LED12  78,66 270 bottom
LED13  82,56 270 bottom
LED14  83,46 270 bottom
LED15  83,34 270 bottom
LED16  82,24 270 bottom
LED17  79,14 270 bottom
LED18  74,4 270 bottom
Q1  73.38,69.53 90 bottom
R1  54.78,12.05 90 top
R2  64.36,30.79 0 top
R3  67,46.61 180 top
R4  59.82,62.72 180 top
R5  54.43,4.77 270 top
R6  71.91,38.61 0 top
R7  71.91,41.39 0 top
R8  41.2,67.64 90 top
R9  39.8,59.13 0 top
R10  40.71,53.34 0 top
R11  65.69,27.33 90 top
R12  62.35,17.93 270 top
R13  45.72,65.49 0 top
R14  32.72,28.52 0 top
R15  61,34.33 270 top
R16  59.33,35.21 270 top
R17  11.45,37.19 90 top
R18  11.45,42.98 270 top
R19  67,73 0 bottom
R20  73,63 0 bottom
R21  77.05,53.07 0 bottom
R22  77.7,44.52 0 bottom
R23  79.83,39.13 0 bottom
R24  77,27 0 bottom
R25  74,17 0 bottom
R26  69,7 0 bottom
R27  67,76 0 bottom
R28  73,66 0 bottom
R29  77,56 0 bottom
R30  77.7,47.83 0 bottom
R31  78,34 0 bottom
R32  77,24 0 bottom
R33  74,14 0 bottom
R34  69,4 0 bottom
R35  70.42,69.53 270 bottom
R36  26.99,42.06 270 bottom
R37  26.99,38.4 90 bottom
R38  27.6,34.75 180 bottom
R39  27.6,32.61 180 bottom
R40  31.26,54.25 270 top
R41  33.09,53.04 270 bottom
R42  29.74,53.64 180 bottom
RESET  69,21 135 top
SJ1  39.49,57.3 270 bottom
SJ2  37.05,57.3 270 bottom
T1  39.19,63.7 0 top
T2  39.8,56.39 180 top
TP1  43.15,15.46 0 top
TP2  42.54,60.91 0 top
TP3  29.62,19.42 0 top
TP4  2,18 0 top
U2  36.7,20.81 180 top
U3  37.07,40.08 135 top
U4  34,57.61 0 top
U$1  21,51 0 top
U$2  21,71 270 top
U$3  21,29 180 top
U$4  21,9 90 top
U$5  [DRAGON_LOGO_15MM]  75,48 270 top
U$6  47,40 90 top
U$7  57,68 355 top
U$8  57,75 355 top
U$9  57,12 5 top
U$10  57,5 5 top
U$11  69,49 45 top
U$12  75,43 45 top
U$13  75,37 315 top
U$14  69,31 315 top
USER  48,73 45 top
X1  55,40 90 top
X2  71,40 270 top
Y1  42.66,30.72 180 top

### Tracks (layer width: path | path; a pad name or v marks a point on that pad's centre or on a via)
+3V3  (via drill 0.35)  (36 unrouted)
  Top 0.305: U3.48 29.2,42.64 29.2,42.65 29.13,42.72 29.13,42.98 29.13,44.2 | U3.64 35.66,32.79 37.66,30.79 37.66,29.66 37.65,29.64 | 35.03,49.49 C1.1 34.92,49.61 | U3.32 37.42,47.85 36.75,47.85 | 30.96,55.78 30.96,55.47 31.04,55.56 | 30.96,55.78 30.96,56.39 | U4.5 31.43,56.86 30.96,56.39 | U4.6 30.99,56.36 30.96,56.39 | U4.7 31.26,55.56 R40.1 | R40.1 29.77,55.2 29.43,54.86 C29.1 28.55,53.98 28.15,53.58 C8.1 | R40.1 30.96,55.51 30.96,55.78 | R14.2 33.67,29.59 v33.09,30.18
  Top 0.406: 28.98,44.65 29.13,44.5 29.13,44.2 29.13,42.98 29.13,41.15 30.04,40.23 34.31,40.23 37.05,42.98 | 28.98,44.65 28.15,45.48 C9.1 C8.1 28.15,44.14 26.69,42.67 24.95,42.67 J2.4 | v38.88,28.96 38.2,29.64 37.65,29.64 | 37.97,42.06 37.05,42.98 | 37.05,42.98 37.05,47.55 36.75,47.85 35.83,47.85 35.03,48.65 35.03,49.49 | 28.52,45.11 28.98,44.65
  Top 0.508: 37.65,24.38 U2.1 41.22,22.19 41.45,22.42 | 37.65,24.38 C17.2 | C15.2 37.65,24.38 | L1.P$2 41.45,22.42 | R1.2 54.78,13.09 | 41.59,22.55 41.45,22.42
  Top 0.61: C17.2 39.01,24.81 v39.19,24.99 | v28.82,39.01 28.15,39.68 C9.1 | C16.2 38.33,28.96 v38.88,28.96
  Top 0.813: C17.2 C15.2 37.65,29.64 C16.2
  Bottom 0.305: R39.2 R38.2 28.55,35.39 28.82,35.66 | R36.2 R37.2 28.48,39.35 v28.82,39.01 | v33.09,30.18 33.09,30.79 33.39,31.09
  Bottom 0.406: 39.19,28.65 v38.88,28.96 37.97,29.87 37.97,36.88 40.71,39.62 | J3.4 J2.4
  Bottom 0.61: v39.19,24.99 39.19,20.42 | v28.82,39.01 28.82,35.66 33.39,31.09 35.53,28.96 v38.88,28.96
ADC0  (3 unrouted)
ADC1  (3 unrouted)
ADC2  (3 unrouted)
ADC3  (3 unrouted)
ADC4  (3 unrouted)
ADC5  (3 unrouted)
ADC6  (3 unrouted)
ADC7  (3 unrouted)
ADC8  (3 unrouted)
ADC9  (via drill 0.35)  (3 unrouted)
  Top 0.305: U3.26 39.52,43.59 v38.88,43.59
ADC10  (via drill 0.35)  (3 unrouted)
  Top 0.305: U3.8 40.9,35.83 40.42,36.31 40.36,36.31 v39.49,37.19
ADC11  (3 unrouted)
BOOT  (via drill 0.35)
  Top 0.305: 32.61,33.14 32.74,33.27 | 32.74,33.27 U3.60 34.92,35.45 34.92,38.71 v35.22,39.01 | 32.74,33.27 29.34,29.87 v27.91,29.87 | R14.1 31.29,28.04 v30.65,28.04
  Bottom 0.305: v27.91,29.87 27.91,29.26 29.13,28.04 v30.65,28.04 30.65,20.42 27.6,17.37 6.88,17.37 6.27,16.76 6.27,14.63 4.97,13.33 BOOT.2 | v35.22,39.01 35.22,42.37 36.14,43.28 36.14,55.63 SJ2.2
D+  (via drill 0.35)
  Top 0.305: J1.A6 7.5,40.25 7.18,39.93 7.18,39.62 7.56,39.25 J1.B6 10.46,39.25 11.45,40.23 12.97,40.23 14.19,41.45 v14.19,42.37 | U4.3 28.46,57.86 27.91,57.3 27.91,56.69 28.52,56.08 v28.52,55.47
  Bottom 0.305: v14.19,42.37 14.19,42.98 13.89,43.28 13.89,50.6 17.7,54.41 26.88,54.41 27.64,55.17 28.21,55.17 v28.52,55.47
D-  (via drill 0.35)
  Top 0.305: J1.A7 9.75,39.75 9.93,39.93 9.93,40.54 9.71,40.75 9.62,40.75 | J1.B7 9.62,40.75 | 9.62,40.75 12.57,40.75 12.97,41.15 v12.97,42.67 | U4.4 29.18,57.36 v28.82,57
  Bottom 0.305: 12.97,42.98 v12.97,42.67 12.97,50.6 17.24,54.86 26.69,54.86 v28.82,57
EN_LEFT  (via drill 0.35)
  Top 0.305: U3.40 34.31,43.19 v34.31,42.67 | v15.72,50.56 15.83,50.67 U$1.P$5 U$1.P$4 U$1.P$3 U$1.P$2
  Bottom 0.305: v34.31,42.67 34.31,43.89 32.48,45.72 23.03,45.72 15.72,45.72 15.41,46.02 15.41,48.77 15.41,50.26 v15.72,50.56
EN_RIGHT
  Top 0.305: U3.62 28.91,28.02 25.47,28.02 | 25.47,28.02 U$3.P$3 | U$3.P$4 25.14,28.68 25.47,28.35 25.47,28.04 | 25.47,28.04 25.47,28.02 | U$3.P$5 25.41,29.32 25.47,29.26 25.47,28.04 | 25.47,28.04 25.47,28.02 | U$3.P$2 25.41,27.38 25.47,27.43 25.47,28.04
ENC_LEFT_SCL
  Top 0.305: U3.51 30.29,37.19 28.82,37.19 25.47,40.54 23.95,40.54 22.08,42.4 J2.3
  Bottom 0.305: R36.1 26.99,43.89 25.62,45.26 22.57,45.26 22.08,44.77 J2.3
ENC_LEFT_SDA  (via drill 0.35)
  Top 0.305: U3.52 30.21,36.4 | 30.21,36.4 30.08,36.27 | 30.21,36.4 30.08,36.27 | 30.08,36.27 28.52,36.27 27.6,37.19 | J2.2 19.54,40.68 20.29,39.93 24.86,39.93 27.6,37.19 | v27.3,36.27 27.3,36.88 27.6,37.19
  Bottom 0.305: R37.1 27.3,37.15 v27.3,36.27
ENC_RIGHT_SCL
  Top 0.305: J3.3 22.08,35.39 22.73,34.75 29.27,34.75 U3.53
  Bottom 0.305: J3.3 22.08,35.39 22.73,34.75 R38.1
ENC_RIGHT_SDA
  Top 0.305: U3.57 31.79,34.44 30.35,34.44 30.04,34.14 20.29,34.14 19.54,34.89 J3.2
  Bottom 0.305: R39.1 26.04,33.22 25.16,33.22 24.25,34.14 20.29,34.14 19.54,34.89 J3.2
GND  (via drill 0.35)  (76 unrouted)
  Top 0.305: R18.1 9.75,43.93 9.05,43.23 | U3.47 30.04,42.51 v30.04,44.5 | U3.63 34.61,33.02 34.61,32.46 34.63,32.45 34.63,30.76 35.53,29.86 | C22.1 38.99,49.52 | 38.99,49.52 C1.2 | U3.31 39.49,47.09 39.49,49.02 38.99,49.52 | 39.49,40.23 39.49,40.13 v39.49,40.84 | C20.2 41.56,24.93 v41.32,24.69 | C16.1 35.22,30.16 35.22,30.48 | 35.22,30.48 35.22,30.79 | 35.22,30.48 35.22,31.09 v35.53,31.39 | 29.74,48.95 C8.2 | 3.83,35.66 6.89,35.66 6.94,35.62 9.55,35.62 9.62,35.68 | U$1.P$15 24.86,49.38 25.16,49.07 25.16,48.23 | 26.42,46.97 C25.1 | 29.57,51.95 C29.2 | U4.PAD 33.25,58.36 U4.2 30.82,58.36 30.35,58.83 v29.74,58.83 | BOOT.1 4,19.37 4.9,20.27
  Top 0.406: v30.04,44.5 30.04,46.45 C9.2 C8.2 | C22.1 37.06,49.68 C1.2 37.05,49.38 v37.66,49.38 | TP3.TP 29.63,19.44 30.72,19.44 | U$3.P$12 20.1,33.34 | 20.1,33.34 20.23,33.47 21.51,33.47 | 21.51,33.47 21.56,33.47 21.9,33.13 U$3.P$10 | U$3.P$15 16.79,30.62 16.16,31.25 C6.2 15.67,31.2 | 15.67,30.18 C7.2 15.94,29.32 U$3.P$17 U$3.P$18 | 15.67,30.18 15.67,31.2 | 16.01,32.31 C28.1 14.97,33.36 v14.8,33.53 | 16.01,32.31 16.01,31.54 15.67,31.2 | U$3.P$16 15.87,29.98 15.67,30.18 | 20.1,33.34 19.91,33.53 v19.37,33.53 | 21.51,33.47 21.87,33.47 v22.12,33.22 | v16.63,32 16.31,32 16.01,32.31 | v4.13,25.6 4.15,25.6 C11.- | v32.48,25.3 v32.48,26.82 v34,26.82 | U$1.P$10 20.1,46.52 20.59,46.02 | 20.59,46.02 21.51,46.02 21.9,46.42 U$1.P$12 | C25.1 26.53,45.87 26.08,45.41 23.03,45.41 22.42,46.02 20.59,46.02 | U$1.P$16 23.98,50.02 v24.86,50.9 | U$1.P$17 24.63,50.67 v24.86,50.9 | U$1.P$18 24.44,51.33 v24.86,50.9 | v24.86,50.9 25.16,50.6 25.16,48.23 25.42,47.97 25.43,47.97 25.64,47.76 25.64,47.75 26.42,46.97
  Top 0.508: J1.GND 8.66,43.74 J1.SHLD1 3.95,44.32 3.83,44.2 | J1.GND2 8.66,36.26 J1.SHLD2 | J1.SHLD2 8.07,35.66 | 3.98,49.53 3.83,49.68 | 3.83,48.77 4.44,48.77 v5.05,48.16 | J1.SHLD2 9.62,35.68 10.89,35.68 R17.1 | 35.53,29.86 35.74,29.64
  Top 0.61: 20.59,46.02 16.94,46.02 | 16.94,46.02 15.72,46.02 14,47.74 C5.2 | C5.2 C4.2 | C5.2 12,50.05 7.12,50.05 3.83,53.34 | J2.1 16.94,43.06 16.94,46.02 | C28.1 12.23,33.36 12.06,33.53 6.88,28.35 3.83,28.35 | C8.2 30.05,50 v31.57,51.51 30.01,51.51 29.57,51.95
  Top 0.813: U2.4 34,19.44 32.78,19.44 | 32.78,19.44 31.26,19.44 | 31.26,19.44 30.72,19.44 30.3,19.85 30.3,20.42 C14.1 | C13.1 33,19.65 32.78,19.44 | C17.1 C15.1 | C15.1 35.36,26.82 v34,26.82 | 4.3,25 4.3,23 4.3,20.87 4.9,20.27 5.2,19.96 | 5.2,19.96 5.66,19.51 | C16.1 35.74,29.64 35.74,28.55 | 35.74,28.55 35.74,28.25 C15.1 | 31.19,19.51 31.26,19.44 | 31.26,19.44 31.19,19.51 | 31.19,19.51 28.52,19.51 26.99,17.98 7.18,17.98 5.2,19.96 | 35.67,28.47 35.74,28.55 | v38.27,60.35 38.84,59.78 R9.1 T2.2
  Top 1.27: BATT.1 4.09,64.26 4.09,55.66 C10.- 4.75,54.87 3.83,53.95 3.83,53.34 3.83,49.68 3.83,48.77 3.83,44.2 3.83,35.66 3.83,31.09 3.83,30.48 3.83,28.35 3.83,23.47 4.3,23 | 4.3,25 C11.-
  Bottom 0.305: v39.49,40.84 39.8,40.54 39.8,40.23 | C30.2 30.82,51.65 | 30.82,51.65 31.26,52.09 | v31.57,51.51 31.43,51.65 30.82,51.65 | R41.2 33.12,52.12 | v29.74,58.83 32.17,58.83 34.31,56.69 34.31,52.43 33.97,52.09 R41.2 | R41.2 31.26,52.09 | 31.26,52.09 30.82,51.65
  Bottom 0.406: 34,25.6 37.05,25.6 38.88,27.43 40.71,27.43 40.71,25.3 v41.32,24.69 | 40.1,40.54 39.8,40.23 39.64,40.08 | 39.64,40.08 37.05,37.49 37.05,35.05 | 37.05,35.05 37.05,31.7 36.75,31.39 v35.53,31.39 | 37.05,35.05 v33.09,39.01 30.35,41.76 30.35,44.2 v30.04,44.5 | v37.66,49.38 37.66,42.06 39.64,40.08 | J2.1 J3.1 | v14.8,33.53 v19.37,33.53 | v22.12,33.22 20.9,32 v16.63,32
  Bottom 0.61: 38.88,11.28 34,16.15 34,19.51
  Bottom 0.813: BATT.1 4.95,63.4 26.99,63.4 35.53,63.4 38.42,60.5 | v34,26.82 34,25.6 34,24.08 34,19.51 v34,18.9
  other vias: 3.52,32.92 9.62,45.11 32.48,18.9 5.96,61.57 5.96,60.35 4.13,61.57 4.13,60.35 4.13,59.13 5.96,59.13 14.5,62.18 30.96,18.9 39.49,30.18 37.05,41.15 33.09,41.15 30.96,69.19 26.38,25.3 28.82,21.03 26.08,47.85 18.76,65.53 28.21,15.24 12.36,15.24 14.5,20.73 11.14,33.22 9.92,50.6 11.75,58.22 16.33,57.61 29.13,26.21 37.36,54.86 31.87,61.87 37.05,63.7 41.62,63.7
IR_CON  (5 unrouted)
  Top 0.406: R8.1 41.2,66.63
  Top 0.61: R5.1 54.46,5.75 | R8.1 39.19,64.67 T1.C
IR_LED  (1 unrouted)
LED  (1 unrouted)
LINE_LED  (4 unrouted)
LINE_LED_CON  (8 unrouted)
N$1
  Top 0.305: U$1.P$21 23.93,53.93 24.95,54.95 C23.1
N$2
  Top 0.305: U$1.P$20 25.57,52.62 C23.2
N$3
  Top 0.305: U$1.P$19 25.59,51.98 C24.2
N$4
  Top 0.305: U$1.P$14 24.63,48.02 C25.2
N$5  (1 unrouted)
N$6  (1 unrouted)
N$7  (1 unrouted)
N$8  (1 unrouted)
N$10  (1 unrouted)
  Top 0.305: T1.E 40.74,61.66 40.74,59.44 R9.2 T2.1
  Top 0.813: T1.E 40.74,61.66 R9.2
N$11
  Top 0.305: J1.B5 11.33,38.25 R17.2
N$12
  Top 0.508: U2.6 38.58,18.51 38.58,16.88 C12.1
N$13
  Top 0.508: U2.5 36.74,19.39 C12.2 36.74,15.55 37.05,15.24 40.1,15.24 41.7,16.84 L1.P$1
N$14
  Top 0.305: R10.1 39.76,55.25 T2.3 39.3,55.78 37.97,55.78 37.36,56.39 37.36,61.39 T1.B
N$16  (1 unrouted)
N$17  (1 unrouted)
N$18
  Top 0.305: J1.A5 10.67,41.25 R18.2
N$19  (2 unrouted)
  Top 0.305: U3.5 39.9,34.71 40.38,34.23 40.38,30.5 41.05,29.84
N$20  (2 unrouted)
  Top 0.305: 40.3,35.13 U3.6
N$21  (1 unrouted)
N$22  (1 unrouted)
N$23
  Top 0.305: U3.30 41.05,47.94 C22.2
N$24  (1 unrouted)
N$25  (1 unrouted)
N$26  (1 unrouted)
N$27  (1 unrouted)
N$28  (1 unrouted)
N$29  (1 unrouted)
N$31
  Top 0.406: U$3.P$21 17.75,26.73 17.24,26.21 17.24,25.3 17.08,25.14 C26.1
N$32
  Top 0.406: U$3.P$20 16.25,27.38 C26.2
N$33  (via drill 0.35)
  Top 0.305: U4.23 33.25,60.19 32.78,60.66 32.78,61.57 33.39,62.18 v34.61,62.18
  Bottom 0.305: SJ1.1 38.12,59.44 37.66,59.44 37.36,59.74 37.36,60.35 35.53,62.18 v34.61,62.18
N$34  (via drill 0.35)
  Top 0.305: U4.19 36.36,59.66 v36.44,59.74
  Bottom 0.305: SJ2.1 37.05,58.98 36.44,59.59 v36.44,59.74
N$35
  Top 0.406: U$3.P$19 17.26,28.02 16.94,28.35 14.5,28.35 13.99,27.84 C27.2
N$36
  Top 0.406: U$3.P$14 18.07,33.19 C28.2
N$37
  Top 0.305: R40.2 33.66,53.3 34,53.65 34,54.56 33.75,54.81 U4.9
N$38  (via drill 0.35)
  Top 0.305: U4.8 v33.25,54.15
  Bottom 0.305: R41.1 v33.25,54.15 32.75,53.65 R42.2
PWM_LEFT_A  (via drill 0.35)
  Top 0.305: U3.37 33.7,45.92 33.7,47.4 33.55,47.55 33.55,48.01 v33.7,48.16 | U$1.P$6 16.67,50.02 v16.33,49.68
  Bottom 0.305: v33.7,48.16 32.17,48.16 30.35,49.99 16.63,49.99 v16.33,49.68
PWM_LEFT_B  (via drill 0.35)
  Top 0.305: U3.38 32.48,46.44 32.48,46.94 v32.78,47.24 | U$1.P$7 17.24,49.38 16.63,48.77 v16.63,48.46
  Bottom 0.305: v32.78,47.24 31.87,47.24 30.04,49.07 19.98,49.07 17.24,49.07 v16.63,48.46
PWM_LEFT_C  (via drill 0.35)
  Top 0.305: U3.39 34.32,43.89 v35.22,43.89 | v17.55,47.85 17.55,48.2 U$1.P$8
  Bottom 0.305: v35.22,43.89 32.78,46.33 19.07,46.33 v17.55,47.85
PWM_RIGHT_A  (via drill 0.35)
  Top 0.305: v26.69,30.48 26.38,30.18 26.18,29.98 U$3.P$6 | U3.58 30.67,32.61 v30.04,32.61
  Bottom 0.305: v30.04,32.61 30.04,31.39 29.43,30.79 26.99,30.79 v26.69,30.48
PWM_RIGHT_B
  Top 0.305: U3.59 30.4,31.64 26.33,31.64 25.31,30.62 U$3.P$7
PWM_RIGHT_C  (via drill 0.35)
  Top 0.305: U3.61 29.13,28.96 v26.38,28.96 | v24.25,32.61 24.25,31.6 U$3.P$8
  Bottom 0.305: v26.38,28.96 24.25,28.96 23.64,29.57 23.64,32.31 23.95,32.61 v24.25,32.61
RESET  (via drill 0.35)  (3 unrouted)
  Top 0.305: U3.7 40.23,35.86 40.17,35.86 39.76,36.27 38.88,36.27 v36.44,38.71
  Bottom 0.305: v36.44,38.71 36.44,40.23 36.14,40.54 36.14,42.37 36.75,42.98 36.75,53.03 39.49,55.78 SJ1.2
SCL  (3 unrouted)
SDA  (3 unrouted)
UART_RX  (via drill 0.35)  (1 unrouted)
  Top 0.305: U3.43 31.26,44.12 31.26,48.77 v32.48,49.99 34.61,52.12 37.36,52.12 v37.97,52.73 | v33.7,60.96 34.25,60.41 U4.21
  Bottom 0.305: 32.78,49.99 v32.48,49.99 33.39,49.99 34.92,51.51 34.92,57.61 33.7,58.83 v33.7,60.96 | v37.97,52.73 38.58,52.12 39.19,52.12
UART_TX  (via drill 0.35)  (1 unrouted)
  Top 0.305: U3.42 31.87,44.22 31.87,48.16 v32.78,49.07 33.39,49.07 33.7,49.38 33.7,50.05 34.23,50.58 34.29,50.58 34.92,51.21 37.66,51.21 v37.97,50.9 | U4.20 34.75,60.8 v34.92,60.96
  Bottom 0.305: v32.78,49.07 33.39,49.07 35.53,51.21 35.53,58.22 35.38,58.37 35.38,59.32 34.92,59.78 v34.92,60.96 | v37.97,50.9 38.17,51.1 38.17,51.31
USER_KEY  (1 unrouted)
VBUS  (via drill 0.35)
  Top 0.508: J1.VBUS1 9.84,42.45 v9.93,42.37 | J1.VBUS2 9.87,37.55 9.93,37.49 v9.93,36.88 | v8.4,34.44 8.33,34.37 D1.A
  Bottom 0.305: 9.93,41.15 10.53,40.54 14.8,40.54 15.11,40.84 15.11,43.89 14.8,44.2 14.8,50.62 15.43,51.25 15.45,51.25 17.85,53.65 R42.1 C30.1
  Bottom 0.508: v9.93,42.37 9.93,41.15 v9.93,36.88 9.93,34.75 9.62,34.44 v8.4,34.44
VCC  (via drill 0.35)  (6 unrouted)
  Top 0.305: C24.1 26.67,49.35 27.6,50.29 27.6,55.78 26.69,56.69 v25.47,56.69
  Top 0.406: U$3.P$23 20.1,24.81 v19.68,24.38 | U$3.P$25 21.9,24.6 v22.12,24.38 | C5.1 C4.1 | U$1.P$25 20.1,55.36 v19.68,55.78 | U$1.P$23 21.9,55.26 v22.42,55.78
  Top 0.508: 8.1,24.22 v8.1,24.38 | 8.1,21.78 v8.1,21.34 | U2.2 36.7,22.91 36.32,23.29 35.53,23.29 | 35.53,23.29 C13.2 | U2.3 35.74,23.07 35.53,23.29 | D1.C 7.11,32.07 v7.49,31.7
  Top 0.61: C4.1 16.02,53.97 v16.02,54.86 | C5.1 14,54.67 v14.19,54.86
  Top 0.813: C13.2 C14.2 | 30.35,23.33 C14.2 | C10.+ 19.95,63.7 33.84,63.7 40.09,69.95 40.16,69.99 40.24,70.23 40.42,70.41 40.42,70.77 41.32,73.45 | C27.1 12.31,25.35 12.06,25.6 12.06,30.79 12.52,31.25 C6.1 13.77,31.2 C7.1 | C27.1 13.99,23.97 | 13.99,23.97 14.8,23.16 | 14.8,23.16 v15.11,23.16 | C14.2 28.95,23.29 26.99,21.34 26.99,20.42 25.77,19.2 9.01,19.2 8.1,20.12 v8.1,21.34 | 13.99,23.97 14.8,23.16 | 14.8,23.16 v16.02,23.16 | C27.1 11.6,25.35 C11.+
  Top 1.27: C10.+ 7.79,58.46 | 11.31,25 C11.+ 9,25 8.4,25.6 8.1,25.3 8.1,24.22 | 7.79,58.46 7.79,60.46 7.79,63.75 5.85,65.69 5.85,67.17 5.35,67.67 BATT.2 | 7.79,58.46 v7.79,55.17 | v7.79,55.17 7.79,53.78 | 7.79,53.78 v6.57,52.56 | v7.79,55.17 7.79,53.78 | 7.79,53.78 v9.01,52.56 | v8.1,24.38 v8.1,22.55 v8.1,21.34
  Bottom 0.305: v25.47,56.69 24.55,55.78 v22.42,55.78
  Bottom 0.508: 6.88,52.25 v6.57,52.56 | v7.49,31.7 6.35,31.7
  Bottom 0.61: v22.42,55.78 v19.68,55.78 16.02,55.78 | 16.02,55.78 14.19,55.78 | 14.19,55.78 8.4,55.78 v7.79,55.17 | v16.02,54.86 16.02,55.78 | v14.19,54.86 14.19,55.78
  Bottom 0.813: 15.72,24.38 v19.68,24.38 v22.12,24.38 | v15.11,23.16 15.11,23.77 15.72,24.38 | 15.72,24.38 16.02,24.08 v16.02,23.16
  Bottom 1.27: 6.88,51.51 6.88,46.03 5.92,45.07 5.92,44.11 5.88,44.07 5.88,34.46 6.35,33.99 | 6.88,51.51 6.88,52.25 6.88,52.95 | 6.35,34.14 6.35,33.99 | 6.35,33.99 6.35,31.7 6.35,26.21 6.35,24.3 v8.1,22.55 | 6.88,51.51 6.88,52.73 7.79,53.65 v7.79,55.17 | v6.57,52.56 v9.01,52.56
YLA
  Top 0.406: U$1.P$9 U$1.P$26 19.2,54.43 18.46,55.17 U$2.P$3
YLB
  Top 0.406: U$2.P$2 U$1.P$24 U$1.P$11
YLC
  Top 0.406: U$1.P$13 U$1.P$22 22.8,54.63 23.64,55.47 23.64,58.2 U$2.P$1
YRA
  Top 0.406: U$3.P$9 U$3.P$26 22.8,25.23 23.64,24.38 23.64,21.8 U$4.P$3
YRB
  Top 0.406: U$3.P$11 U$3.P$24 U$4.P$2
YRC
  Top 0.406: U$4.P$1 18.46,24.39 19.2,25.12 U$3.P$13 U$3.P$22

### Text on the board
tNames: + | user | gnd | reset | boot